# Altium schematic sheet Power.SchDoc
size A4
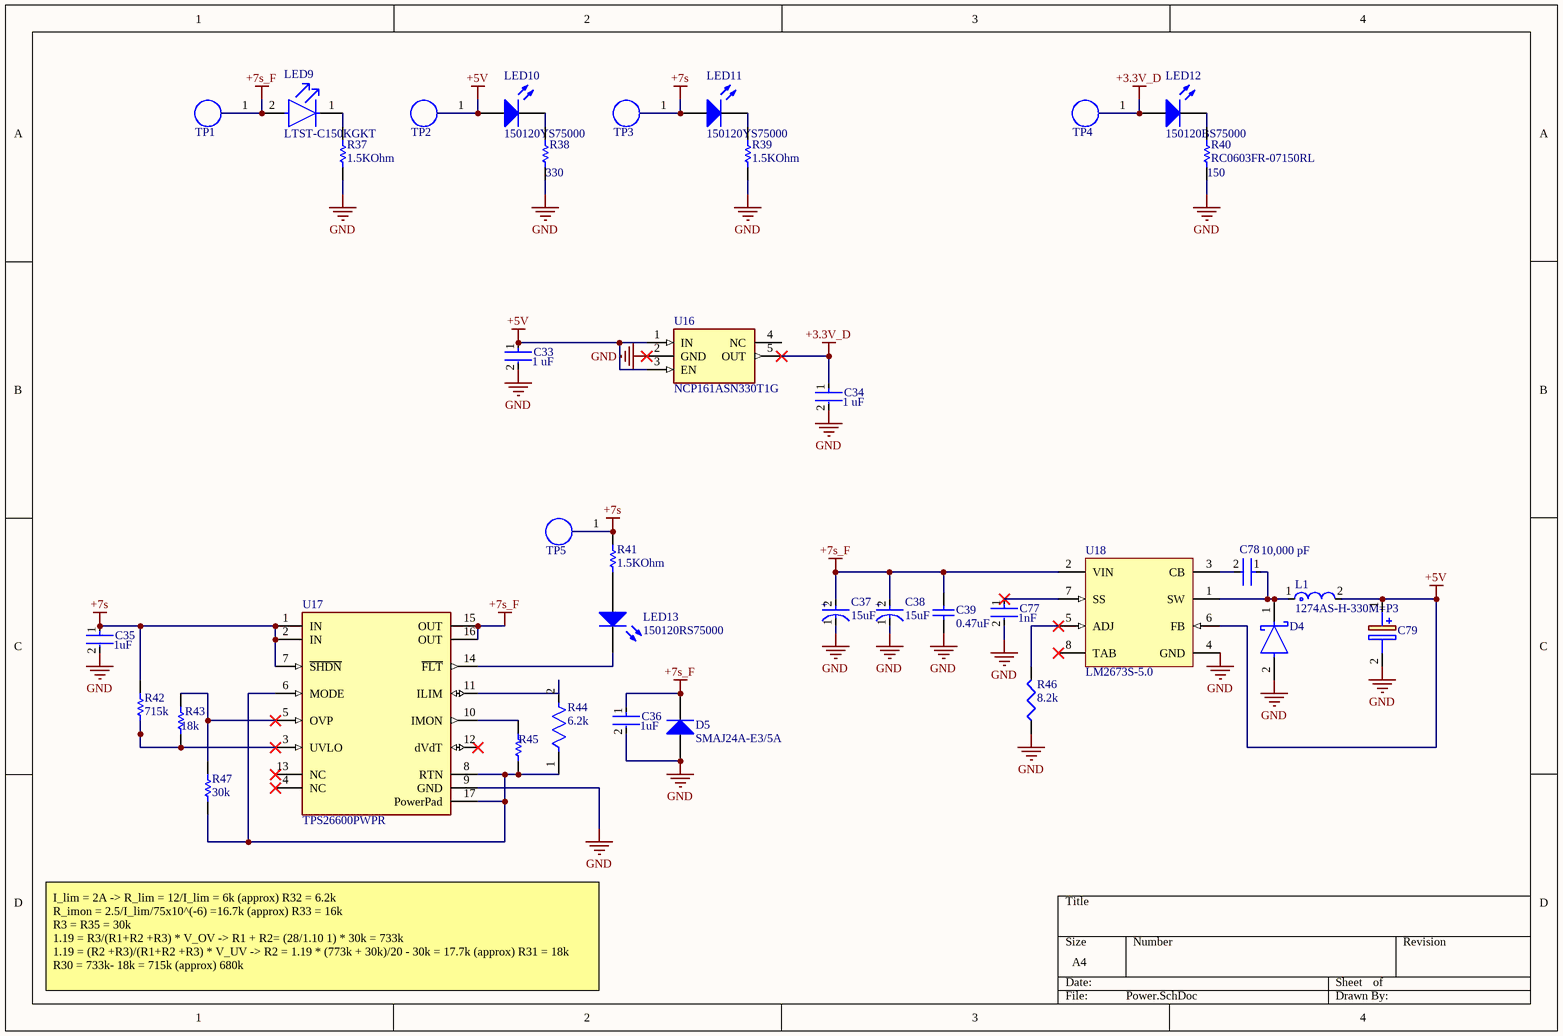
[diagram p0: Power.SchDoc]

## Parts
C33  Capacitance: 1 uF  [FP-CC0402-MFG]  (hidden comment: CC0402KRX5R5BB105)
C34  Capacitance: 1 uF  [FP-CC0402-MFG]  (hidden comment: CC0402KRX5R5BB105)
C35  Capacitance: 1uF  [FP-CGA4J-IPC_C]  (hidden comment: CGA4J3X7S2A105M125AE)
C36  Capacitance: 1uF  [FP-CGA4J-IPC_C]  (hidden comment: CGA4J3X7S2A105M125AE)
C37  value 15uF  [FP-TPSE-MFG]  (hidden comment: TPSE156M050R0250)
C38  value 15uF  [FP-TPSE-MFG]  (hidden comment: TPSE156M050R0250)
C39  Parameter 1: 0.47uF  [CAPC2013X140X50ML20T25]  (hidden comment: C0805F474K3RACTU)
C77  Capacitance: 1nF  [FP-CL10-IPC_C]  (hidden comment: CL10B102KB8NNNC)
C78  value 10,000 pF  [FP-C0805C-DN-MFG]  (hidden comment: C0805C103J5RACTU)
C79  16SVPS180M  [10SVPS150M]  (value not drawn)
D4  PMEG4030ER,115  [FP-SOD123W-MFG]  (value not drawn)
D5  SMAJ24A-E3/5A  [VISH-DO-214AC-2_M]
L1  1274AS-H-330M=P3  [FP-DEM10050C-MFG]
LED9  LTST-C150KGKT  [FP-LTST-C150KGKT-MFG]
LED10  150120YS75000  [1206_A]
LED11  150120YS75000  [1206_A]
LED12  150120BS75000  [1206_A]
LED13  150120RS75000  [1206_A]
R37  Resistance: 1.5KOhm  [RESC1608X55X25ML10T15]  (hidden comment: RC0603FR-071K5L)
R38  value 330  [RESC1608X55X30NL15T15]  (hidden comment: ERJ3EKF3300V)
R39  Resistance: 1.5KOhm  [RESC1608X55X25ML10T15]  (hidden comment: RC0603FR-071K5L)
R40  RC0603FR-07150RL  value 150  [RESC1608X55X25ML10T15]
R41  Resistance: 1.5KOhm  [RESC1608X55X25ML10T15]  (hidden comment: RC0603FR-071K5L)
R42  value 715k  [RESC1608X55X30ML20T10]  (hidden comment: RK73H1JTTD7153F)
R43  value 18k  [RESC1608X55X30LL15T15]  (hidden comment: ERJ3EKF1802V)
R44  Resistance: 6.2k  [FP-RMCF0603-MFG]  (hidden comment: RMCF0603JT6K20)
R45  ERA-3AEB163V  [RESC1608X55X30NL20T20]  (value not drawn)
R46  value 8.2k  [J1-0603]  (hidden comment: Res3)
R47  value 30k  [RESC1608X55X30ML20T10]  (hidden comment: RK73H1JTTD3002F)
TP1  TP_1  [TestPoint]  (value not drawn)  (no BOM)
TP2  TP_1  [TestPoint]  (value not drawn)  (no BOM)
TP3  TP_1  [TestPoint]  (value not drawn)  (no BOM)
TP4  TP_1  [TestPoint]  (value not drawn)  (no BOM)
TP5  TP_1  [TestPoint]  (value not drawn)  (no BOM)
U16  NCP161ASN330T1G  [SOT95P280X145-5N]
U17  TPS26600PWPR  [FP-PWP0016H-MFG]
U18  LM2673S-5.0  [KTW0007B_N]

## Nets
+3.3V_D: C34.1 LED12.2(A) TP4.1 U16.5(OUT)
+5V: C33.1 C79.1(+) L1.2 LED10.2(A) TP2.1 U16.1(IN) U16.3(EN) U18.6(FB)
+7s: C35.1 LED11.2(A) R41.2 R42.2 TP3.1 TP5.1 U17.1(IN) U17.2(IN) U17.7(~{SHDN})
+7s_F: C36.1 C37.2(A) C38.2(A) C39.1 D5.1(K) LED9.2(A) TP1.1 U17.15(OUT) U17.16(OUT) U18.2(VIN)
GND: C33.2 C34.2 C35.2 C36.2 C37.1(C) C38.1(C) C39.2 C77.2 C79.2(-) D4.2(A) D5.2(A) R37.1 R38.1 R39.1 R40.1 R46.1 U16.2(GND) U17.9(GND) U18.4(GND)
NetC77_1: C77.1 U18.7(SS)
NetC78_1: C78.1 D4.1(C) L1.1 U18.1(SW)
NetC78_2: C78.2 U18.3(CB)
NetLED9_1: LED9.1(C) R37.2
NetLED10_1: LED10.1(K) R38.2
NetLED11_1: LED11.1(K) R39.2
NetLED12_1: LED12.1(K) R40.2
NetLED13_1: LED13.1(K) U17.14(~{FLT})
NetLED13_2: LED13.2(A) R41.1
NetR42_1: R42.1 R43.1 U17.3(UVLO)
NetR43_2: R43.2 R47.2 U17.5(OVP)
NetR44_1: R44.1 R45.1 R47.1 U17.6(MODE) U17.8(RTN) U17.17(PowerPad)
NetR44_2: R44.2 U17.11(ILIM)
NetR45_2: R45.2 U17.10(IMON)
NetR46_2: R46.2 U18.5(ADJ)

Not connected (* = marked no-connect by the designer): U16 4(NC); U17 4(NC)* 12(dVdT)* 13(NC)*; U18 8(TAB)*

## Notes on the sheet
- I_lim = 2A -> R_lim = 12/I_lim = 6k (approx) R32 = 6.2k
  R_imon = 2.5/I_lim/75x10^(-6) =16.7k (approx) R33 = 16k
  R3 = R35 = 30k
  1.19 = R3/(R1+R2 +R3) * V_OV -> R1 + R2= (28/1.10 1) * 30k = 733k
  1.19 = (R2 +R3)/(R1+R2 +R3) * V_UV -> R2 = 1.19 * (773k + 30k)/20 - 30k = 17.7k (approx) R31 = 18k
  R30 = 733k- 18k = 715k (approx) 680k
- (in symbol CMP-04424-000028-1) +

## Library data of the parts
C33 C34 = CMP-2100-03591-2: CAP CER 1UF 6.3V X5R 0402; Manufacturer: YAGEO; Automotive Grade: NA; Material: Ceramic; Tolerance: 0.1; Temperature Coefficient: 30ppm/°C; Voltage Rating: 6.3 V; Temperature Range Low: -55°C; Digikey Description: CAP CER 1UF 6.3V X5R 0402; Height: 0.55mm; Automotive: No; ComponentLink2URL: http://www.yageo.com/documents/recent/UPY-GP_NP0_16V-to-50V_16.pdf; Device Class L2: Capacitors; RoHS: TRUE; Temperature Range High: +125°C; Device Class L3: Ceramic Capacitors; Device Class L1: Passive Components; Temperature Characteristic: X5R; Package: CC0402; Octopart: https://octopart.com/cc0402krx5r5bb105-yageo-42244618; ComponentLink2Description: Datasheet; Temperature: -55°C to +125°C; Manufacturer Part Number: CC0402KRX5R5BB105; Mouser Description: Multilayer Ceramic Capacitors MLCC - SMD/SMT 1uF 6.3V X5R 10%; Category: Cap; Footprint Url: http://www.yageo.com/exep/pages/download/literatures/UPY-C_GEN_24.pdf; Lead Free: Yes; Ipc Land Pattern Name: CAPC10050X50; Value: 1 uF
C35 C36 = CMP-08246-000293-1: Cap Ceramic 1uF 100V X7S 20% Pad SMD 0805 +125°C Automotive T/R; Width: 1.2mm; Height: 1.25mm; Max Operating Temperature: 125°C; Case/Package: 0805; Tolerance: 20%; Termination: SMD/SMT; Lead Free: Lead Free; Mount: Surface Mount; Radiation Hardening: No; Depth: 1.25mm; Ratings: AEC-Q200; Case Code (Metric): 2012; Length: 2mm; Thickness: 0.049inch; REACH SVHC: No SVHC; Weight: 0.000194oz; Packaging: Tape and Reel; Case Code (Imperial): 0805; Dielectric: X7S; Features: Soft Termination; Voltage Rating (DC): 100V; Voltage Rating: 100V; Package Quantity: 1; Min Operating Temperature: -55°C
C37 C38 = CMP-04424-000028-1: CAP TANT 15UF 20% 50V 2917; Manufacturer: AVX Corporation; Ripple Current: 0.812A; Esr: 250mΩ; Leakage Current: 7.5uA; Dissipation Factor: 6%; Material: Tantalum Mn02 solid electrolyte; Life: 1000Hours; Device Class L2: Capacitors; Lead Free: Yes; Temperature Range High: +125°C; ComponentLink2Description: Datasheet; Height: 4.3mm; Temperature: -55°C to +125°C; Octopart: https://octopart.com/tpse156m050r0250-avx-7476984; Mouser Description: Tantalum Capacitors - Solid SMD 15uF 20% 50Volts; Device Class L1: Passive Components; Category: Cap; Digikey Description: CAP TANT 15UF 20% 50V 2917; RoHS: TRUE; Temperature Range Low: -55°C; Voltage Rating: 50V; Capacitance: 15uF; Tolerance: 20%; Automotive: No; Package: TPSE; ComponentLink2URL: http://datasheets.avx.com/TPS.pdf; Device Class L3: Tantalum Capacitors; Manufacturer Part Number: TPSE156M050R0250; Footprint Url: https://www.avx.com/download/software/literature/AVX-Footprint-Library.pdf
C39 = CMP-2007-03309-1: Manufacturer: Kemet; Part Number: C0805F474K3RACTU
C77 = CMP-2000-06091-2: Cap Ceramic 1nF 50V X7R ±10% Pad SMD 0603 +125°C T/R; Radiation Hardening: No; Length: 1.6mm; Voltage Rating: 50V; Case Code (Imperial): 0603; Case Code (Metric): 1608; Max Operating Temperature: 125°C; Thickness: 0.035inch; Voltage Rating (DC): 50V; Contact Plating: Tin; Width: 0.031inch; Mount: Surface Mount; Lead Free: Lead Free; Voltage: 50V; Material: Ceramic; Package Quantity: 1; Dielectric: X7R; Case/Package: 0603; Height: 0.8mm; Min Operating Temperature: -55°C; Tolerance: 10%; Depth: 0.8mm; Packaging: Tape and Reel
C78 = CMP-2007-00254-2: CAP CER 10000PF 50V X7R 0805; Manufacturer: KEMET; Material: Ceramic; Temperature Coefficient: 30ppm/°C; Tolerance: 0.05; Device Class L1: Passive Components; Temperature: -55°C to +125°C; Lead Free: Yes; ComponentLink2URL: https://content.kemet.com/datasheets/KEM_C1003_C0G_SMD.pdf; Device Class L3: Ceramic Capacitors; Temperature Characteristic: X7R; Temperature Range High: +125°C; Mouser Description: Capacitor; Ceramic; Cap 0.01uF; Tol 5%; Vol-Rtg 50 V; SMT; Case 0805; X7R; TR; ComponentLink2Description: Datasheet; Manufacturer Part Number: C0805C103J5RACTU; Height: 0.88mm; Digikey Description: CAP CER 10000PF 50V X7R 0805; Capacitance: 10,000 pF; Temperature Range Low: -55°C; Device Class L2: Capacitors; Octopart: https://octopart.com/c0805c103j5ractu-kemet-133473; Voltage Rating: 50 V; Category: Cap; RoHS: TRUE; Automotive: No; Package: C0805C-DN; Ipc Land Pattern Name: CAPC200125X78
C79 = 16SVPS180M: Capacitor Polarised; Manufacturer_Name: Panasonic; Datasheet Link: http://industrial.panasonic.com/cdbs/www-data/pdf/AAB8000/AAB8000C232.pdf; Height: 8mm; Manufacturer_Part_Number: 16SVPS180M
D4 = CMP-14398-000026-1: DIODE SCHOTTKY 40V 3A SOD123W; RoHS Compliant: Yes
D5 = CMP-0548-00313-2: Transient Voltage Suppressor, 6.40 to 231 V, 24 V Stand-off Voltage, Uni-Directional, -55 to 155 degC, 2-pin DO-214AC, Pb-Free, Tape and Reel; Manufacturer: Vishay Semiconductor; ID (uA): 1; VBR Uni-Directional (V): 6.4 to 231; IFSM: 40 A; VWM (V): 24; PPPM (W): 400, 300; Operating Junction and Storage Temperature Range: -55 to 150 degC; ComponentLink2URL: http://www.vishay.com/docs/88390/smaj50a.pdf; ComponentLink3Description: Package Specification; DatasheetVersion: 12/8/2013; PackageDescription: 2-Pin DO-214AC (SMA), Body 4.245 x 2.665 mm; PackageReference: DO-214AC-2; RoHS: TRUE; Mounting Technology: Surface Mount; Packing: Tape and Reel; ComponentLink1Description: Manufacturer URL; ComponentLink3URL: http://www.vishay.com/docs/88390/smaj50a.pdf; ComponentLink1URL: http://www.vishay.com/; ComponentLink2Description: Datasheet; PartNumber: SMAJ24A-E3/5A
L1 = CMP-06042-015462-1: Shielded Wirewound Inductor 33uH 20% 2500mA 0.0936Ω SMD; Saturation Current: 3.5A; Core Material: Ferrite; Current Rating: 2.5A; Test Frequency: 100kHz; DC Resistance (DCR): 93.6mR; Inductance: 33uH; Mount: Surface Mount; Height - Seated (Max): 0.197inch; Length: 0.394inch; Shielding: Shielded; Resistor Type: Wirewound; Case/Package: SMD/SMT; Max DC Current: 2.5A; Width: 0.394inch; Number of Pins: 2; Tolerance: 20%; Packaging: Tape and Reel
LED9 = CMP-22017-000010-1: LED GREEN CLEAR 1206 SMD; Power Dissipation: 75mW; Number of LEDs: 1; Reverse Voltage: 5V; Lens Style: Diffused; Test Current: 20mA; Forward Current: 30mA; Luminous Intensity: 71mcd; Dominant Wavelength: 571nm; Lens Color: Colorless; Viewing Angle: 130°; Forward Voltage: 2V; Wavelength: 574nm; Length: 3.2mm; Case Code (Imperial): 1206; Illumination Color: Green; Number of Pins: 2; Case Code (Metric): 3216; Package Quantity: 1; Height: 1.1mm; Power Rating: 75mW; Color: Green; Lead Free: Lead Free; Mount: Surface Mount; Radiation Hardening: No; Max Operating Temperature: 85°C; Depth: 1.6mm; Case/Package: 1206; Number of Elements: 1; Lens Transparency: Clear; Min Operating Temperature: -55°C; Packaging: Tape and Reel; Width: 1.6mm
LED10 LED11 = CMP-1426-00019-1: SMD mono-color Chip LED, WL-SMCW, Yellow; Manufacturer: Wuerth Elektronik; ComponentLink2URL: http://katalog.we-online.com/led/datasheet/150120YS75000.pdf; PartNumber: 150120YS75000; ComponentLink1URL: http://www.we-online.com; Color: Yellow; ComponentLink1Description: Manufacturer URL; PackageReference: 1206_A; ComponentLink2Description: Datasheet
LED12 = CMP-1426-00015-1: SMD mono-color Chip LED, WL-SMCW, Blue; Manufacturer: Wuerth Elektronik; ComponentLink2Description: Datasheet; ComponentLink1URL: http://www.we-online.com; PartNumber: 150120BS75000; ComponentLink1Description: Manufacturer URL; ComponentLink2URL: http://katalog.we-online.com/led/datasheet/150120BS75000.pdf; PackageReference: 1206_A; Color: Blue
LED13 = CMP-1426-00013-1: SMD mono-color Chip LED, WL-SMCW, Red; Manufacturer: Wuerth Elektronik; Color: Red; ComponentLink2URL: http://katalog.we-online.com/led/datasheet/150120RS75000.pdf; ComponentLink2Description: Datasheet; ComponentLink1Description: Manufacturer URL; ComponentLink1URL: http://www.we-online.com; PartNumber: 150120RS75000; PackageReference: 1206_A
R37 R39 R41 = CMP-2100-03665-1: Chip Resistor, 1.5 KOhm, +/- 1%, 0.1 W, -55 to 155 degC, 0603 (1608 Metric), RoHS, Tape and Reel; Manufacturer: Yageo; Power Rating: 100mW; Voltage Rating: 50V; Temperature Coefficient: 100ppm/degreesC; Military Standard: Not; Datasheet URL: http://www.yageo.com/NewPortal/yageodocoutput?fileName=/pdf/R-Chip/PYu-RC_Group_51_RoHS_L_5.pdf; Package Description: 2-Pin Surface Mount Device, Body 1.6 x 0.8 mm; Composition: ThickFilm; Case Code (Metric): 1608; Case/Package: 0603; Number of Terminations: 2; Depth: 0.8mm; Height: 0.022inch; Manufacturer URL: http://www.yageo.com/; Lead Free: LeadFree; Min Operating Temperature: -55degC; Max Operating Temperature: 155degC; Datasheet Version: Rev. 5, 10/2016; RoHSCompliant: true; Max Power Dissipation: 100mW; Packaging: TapeandReel; Voltage Rating (DC): 50V; Length: 0.063inch; Tolerance: 1%; Width: 0.031inch; Number of Pins: 2; Termination: SMD/SMT; Package Reference: 0603; Package Quantity: 1; Case Code (Imperial): 0603; REACH SVHC: NoSVHC
R38 = CMP-2000-00435-1: Manufacturer: Panasonic; Part Number: ERJ3EKF3300V
R40 = CMP-1659-00057-1: Chip Resistor, 150 Ohm, +/- 1%, 0.1 W, -55 to 155 degC, 0603 (1608 Metric), RoHS, Tape and Reel; Viewing Angle: 20 degrees; Luminous Intensity: 200 mcd; Case\Package: Radial; Lens Style: Clear; Nominal Vf: 2.2 V; Illumination Colour: Green; PackageReference: 0603; PackageDescription: 2-Pin Surface Mount Device, Body 1.6 x 0.8 mm; Package Quantity: 1000; Packaging: Bulk; DatasheetVersion: Rev. 4, 02/2016; ComponentLink2URL: http://www.yageo.com/documents/recent/PYu-RC_Group_51_RoHS_L_04.pdf; ComponentLink1Description: Manufacturer URL; Height: 8.6 mm; ComponentLink2Description: Datasheet; Mount: Through Hole; Colour: Green; RoHSCompliant: true; ComponentLink1URL: http://www.yageo.com/; Forward Voltage: 2.2 V
R42 = CMP-2000-01662-1: Manufacturer: KOA Speer; Part Number: RK73H1JTTD7153F
R43 = CMP-2000-00295-1: Manufacturer: Panasonic; Part Number: ERJ3EKF1802V
R44 = CMP-26527-001015-1: 6.2kΩ ±5% 0.1W 0603 Thick Film Chip Resistor AEC-Q200 compliant; Max Power Dissipation: 100mW; Temperature Coefficient: 200ppm/°C; Radiation Hardening: No; Length: 0.061inch; Contact Plating: Tin; Case/Package: 0603; Max Operating Temperature: 155°C; Resistor Type: Thick Film; Case Code (Imperial): 0603; Mount: Surface Mount; Power Rating: 100mW; Min Operating Temperature: -55°C; Case Code (Metric): 1608; Height: 0.022inch; Features: Automotive AEC-Q200; Lead Free: Lead Free; Series: RMCF; Number of Terminations: 2; Size Code: 0603; Width: 0.031inch; Tolerance: 5%; Packaging: Tape and Reel
R45 = CMP-2000-00925-1: Manufacturer: Panasonic; Part Number: ERA-3AEB163V
R46 = Res3: Resistor; Published: 8-Jun-2000; LatestRevisionDate: 29-May-2009; LatestRevisionNote: IPC-7351 Footprint Added.; PackageReference: J1-0603; Publisher: Altium Limited; PackageDescription: Chip Resistor; Supplier 1: Newark; Supplier Part Number 1: 41R4701
R47 = CMP-2000-01398-1: Manufacturer: KOA Speer; Part Number: RK73H1JTTD3002F
TP1-TP5 = TestPoint
U16 = NCP161ASN330T1G: Power Supply; Manufacturer_Name: ON Semiconductor; Datasheet Link: https://componentsearchengine.com/Datasheets/2/NCP161ASN330T1G.pdf; Height: 1.45mm; Manufacturer_Part_Number: NCP161ASN330T1G; Mouser Part Number: 863-NCP161ASN330T1G; Mouser Price/Stock: https://www.mouser.co.uk/ProductDetail/onsemi/NCP161ASN330T1G?qs=vLWxofP3U2ze5zA%252BHmAd3w%3D%3D; Arrow Part Number: NCP161ASN330T1G; Arrow Price/Stock: https://www.arrow.com/en/products/ncp161asn330t1g/on-semiconductor
U17 = CMP-04910-000010-1: IC PWR MGMT EFUSE 60V 16HTSSOP; Manufacturer: Texas Instruments; Number Of Outputs: 1; Nominal Supply Current: 300uA; Min Supply Voltage: 4.2V; Max Junction Temp: +125°C; Standoff Height: 0.05mm; Output Voltage: 2.7V; Device Class L1: Integrated Circuits (ICs); RoHS: TRUE; ComponentLink2Description: Datasheet; Temperature Range Low: -40°C; Max Supply Voltage: 60V; Category: IC; Mouser Description: 60V 2A Industrial eFuse With Integrated Reverse-Input Polarity Protection 16-HTSSOP -40 to 125; Ipc Land Pattern Name: SOP65P640X120-16; Temperature Range High: +125°C; Height: 1.2mm; Package: PWP0016H; Automotive: No; Device Class L2: Power Management ICs; Octopart: https://octopart.com/tps26600pwpr-texas+instruments-75302671; Digikey Description: IC PWR MGMT EFUSE 60V 16HTSSOP; Temperature: -40°C to +125°C; ComponentLink2URL: http://www.ti.com/general/docs/suppproductinfo.tsp?distId=10&gotoUrl=http%3A%2F%2Fwww.ti.com%2Flit%2Fgpn%2Ftps2660; Device Class L3: unset; Lead Free: Yes; Manufacturer Part Number: TPS26600PWPR
U18 = CMP-0069-00173-3: 3A Step-Down Voltage Regulator with Adjustable Current Limit, 7-pin TO-263; Manufacturer: Texas Instruments; PackageTopMarking: NSUZXYTTE#*LM2673*S-5.0; PowerWise: N; CompType: Switcher; PackageDescription: TO-263, Molded, .400 x .390 x .180in Body, 7 Lead, .050in Pitch, Surface Mount; ComponentLink1Description: Datasheet URL; RoHS: N; Code_JEDEC: MO-169-AC; PackageReference: KTW0007B; ComponentLink1URL: http://www.ti.com/general/docs/lit/getliterature.tsp?genericPartNumber=LM2673&fileType=pdf; PinCount: 7